# EAGLE design Minimum System ATMega 8 (EAGLE 9.6.2)
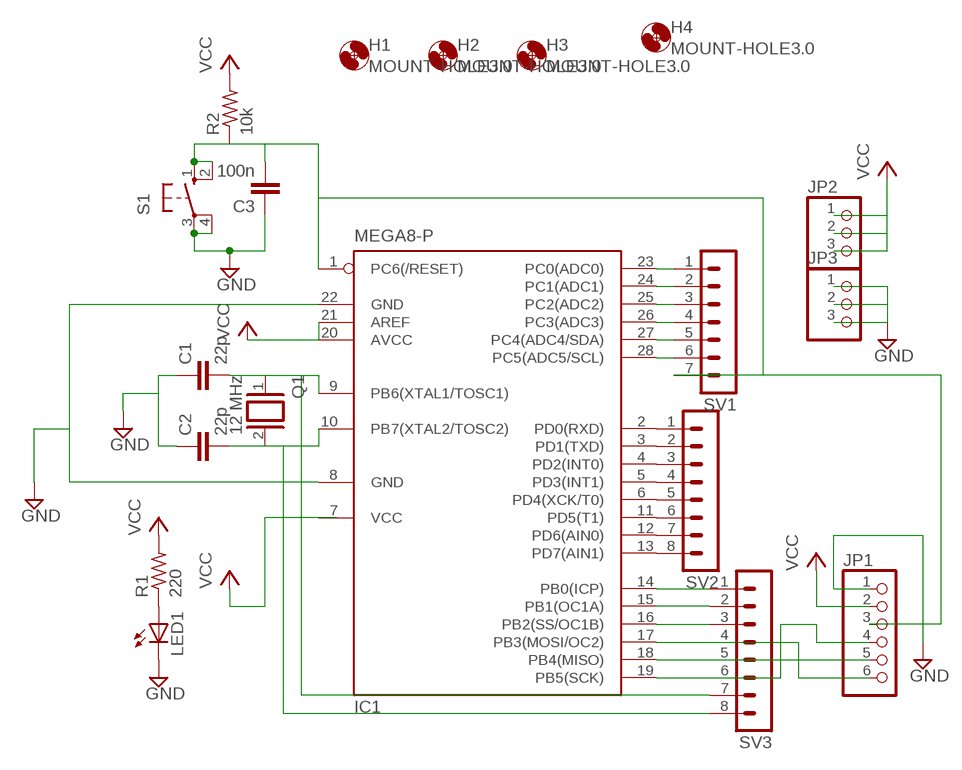
[diagram p0: schematic, sheet 1]

## Parts
C1  22p  C-EU025-030X050  [C025-030X050]
C2  22p  C-EU025-030X050  [C025-030X050]
C3  100n  C-EU025-030X050  [C025-030X050]
H1  MOUNT-HOLE3.0  [3,0]
H2  MOUNT-HOLE3.0  [3,0]
H3  MOUNT-HOLE3.0  [3,0]
H4  MOUNT-HOLE3.0  [3,0]
IC1  MEGA8-P  [DIL28-3]
JP1  PINHD-1X6/90  [1X06/90]
JP2  PINHD-1X3  [1X03]
JP3  PINHD-1X3  [1X03]
LED1  LED3MM  [LED3MM]
Q1  12 MHz  XTAL/S  [QS]
R1  220  R-US_0204/7  [0204/7]
R2  10k  R-US_0204/7  [0204/7]
S1  10-XX  [B3F-10XX]
SV1  MA07-1  [MA07-1]
SV2  MA08-1  [MA08-1]
SV3  MA08-1  [MA08-1]

## Nets
GND: C1.1 C2.1 C3.1 IC1.8(GND) IC1.22(GND) JP1.1 JP3.1 JP3.2 JP3.3 LED1.K(C) S1.3(P) S1.4(P1)
MISO: IC1.18(PB4(MISO)) JP1.5 SV3.5
MOSI: IC1.17(PB3(MOSI/OC2)) JP1.6 SV3.4
N$1: IC1.23(PC0(ADC0)) SV1.1
N$2: IC1.24(PC1(ADC1)) SV1.2
N$3: IC1.25(PC2(ADC2)) SV1.3
N$4: IC1.26(PC3(ADC3)) SV1.4
N$5: IC1.27(PC4(ADC4/SDA)) SV1.5
N$6: IC1.28(PC5(ADC5/SCL)) SV1.6
N$7: IC1.2(PD0(RXD)) SV2.1
N$8: IC1.3(PD1(TXD)) SV2.2
N$9: IC1.4(PD2(INT0)) SV2.3
N$10: IC1.5(PD3(INT1)) SV2.4
N$11: IC1.6(PD4(XCK/T0)) SV2.5
N$12: IC1.11(PD5(T1)) SV2.6
N$13: IC1.12(PD6(AIN0)) SV2.7
N$14: IC1.13(PD7(AIN1)) SV2.8
N$15: IC1.14(PB0(ICP)) SV3.1
N$16: IC1.15(PB1(OC1A)) SV3.2
N$17: IC1.16(PB2(SS/OC1B)) SV3.3
N$18: C1.2 IC1.9(PB6(XTAL1/TOSC1)) Q1.1 SV3.7
N$19: C3.2 IC1.1(PC6(/RESET)) JP1.3 R2.1 S1.1(S) S1.2(S1) SV1.7
N$20: IC1.19(PB5(SCK)) JP1.4 SV3.6
N$22: C2.2 IC1.10(PB7(XTAL2/TOSC2)) Q1.2 SV3.8
N$25: LED1.A R1.1
VCC: IC1.20(AVCC) IC1.21(AREF) JP1.2 JP2.1 JP2.2 JP2.3 R1.2 R2.2

## Power pins joined to a net without a drawn wire
VCC: IC1.7(VCC)

## Library data of the parts
C1-C3 = rcl:C-EU: CAPACITOR, European symbol
H1-H4 = holes:MOUNT-HOLE: MOUNTING HOLE with drill center marker
IC1 = atmel:MEGA8-P: MICROCONTROLLER 8 Kbytes FLASH, 1 kbytes SRAM, 512 bytes EEPROM, USART, 4-channel 10 bit ADC, 2-channel 8 bit ADC Pin compatible with Atmega48, ATMega88, ATMega168 Source: avr.lbr; OC_FARNELL: unknown; OC_NEWARK: unknown
JP1 = pinhead:PINHD-1X6: PIN HEADER
JP2 JP3 = pinhead:PINHD-1X3: PIN HEADER
LED1 = led:LED: LED OSRAM: - CHIPLED LG R971, LG N971, LY N971, LG Q971, LY Q971, LO R971, LY R971 LH N974, LH R974 LS Q976, LO Q976, LY Q976 LO Q996 - Hyper CHIPLED LW Q18S LB Q993, LB Q99A, LB R99A - SideLED LS A670, LO A670, LY A670, LG A670, LP A670 LB A673, LV A673, LT A673, LW A673 LH A674 LY A675 LS A676, LA A676, LO A676, LY A676, LW A676 LS A679, LY A679, LG A679 - Hyper Micro SIDELED® LS Y876, LA Y876, LO Y876, LY Y876 LT Y87S - SmartLED LW L88C, LW L88S LB L89C, LB L89S, LG L890 LS L89K, LO L89K, LY L89K LS L896, LA L896, LO L896, LY L896 - TOPLED LS T670, LO T670, LY T670, LG T670, LP T670 LSG T670, LSP T670, LSY T670, LOP T670, LYG T670 LG T671, LOG T671, LSG T671 LB T673, LV T673, LT T673, LW T673 LH T674 LS T676, LA T676, LO T676, LY T676, LB T676, LH T676, LSB T676, LW T676 LB T67C, LV T67C, LT T67C, LS T67K, LO T67K, LY T67K, LW E67C LS E67B, LA E67B, LO E67B, LY E67B, LB E67C, LV E67C, LT E67C LW T67C LS T679, LY T679, LG T679 LS T770, LO T770, LY T770, LG T770, LP T770 LB T773, LV T773, LT T773, LW T773 LH T774 LS E675, LA E675, LY E675, LS T675 LS T776, LA T776, LO T776, LY T776, LB T776 LHGB T686 LT T68C, LB T68C - Hyper Mini TOPLED® LB M676 - Mini TOPLED Santana® LG M470 LS M47K, LO M47K, LY M47K Source: http://www.osram.convergy.de LUXEON: - LUMILED® LXK2-PW12-R00, LXK2-PW12-S00, LXK2-PW14-U00, LXK2-PW14-V00 LXK2-PM12-R00, LXK2-PM12-S00, LXK2-PM14-U00 LXK2-PE12-Q00, LXK2-PE12-R00, LXK2-PE12-S00, LXK2-PE14-T00, LXK2-PE14-U00 LXK2-PB12-K00, LXK2-PB12-L00, LXK2-PB12-M00, LXK2-PB14-N00, LXK2-PB14-P00, LXK2-PB14-Q00 LXK2-PR12-L00, LXK2-PR12-M00, LXK2-PR14-Q00, LXK2-PR14-R00 LXK2-PD12-Q00, LXK2-PD12-R00, LXK2-PD12-S00 LXK2-PH12-R00, LXK2-PH12-S00 LXK2-PL12-P00, LXK2-PL12-Q00, LXK2-PL12-R00 Source: www.luxeon.com KINGBRIGHT: KA-3528ASYC Source: www.kingbright.com
Q1 = special:XTAL/S: CRYSTAL
R1 R2 = rcl:R-US_: RESISTOR, American symbol
S1 = switch-omron:10-XX: OMRON SWITCH; MPN: B3F-1000; OC_FARNELL: 176432; OC_NEWARK: 36M3542
SV1 = con-lstb:MA07-1: PIN HEADER; OC_FARNELL: unknown; OC_NEWARK: unknown
SV2 SV3 = con-lstb:MA08-1: PIN HEADER; OC_FARNELL: unknown; OC_NEWARK: unknown

## Board
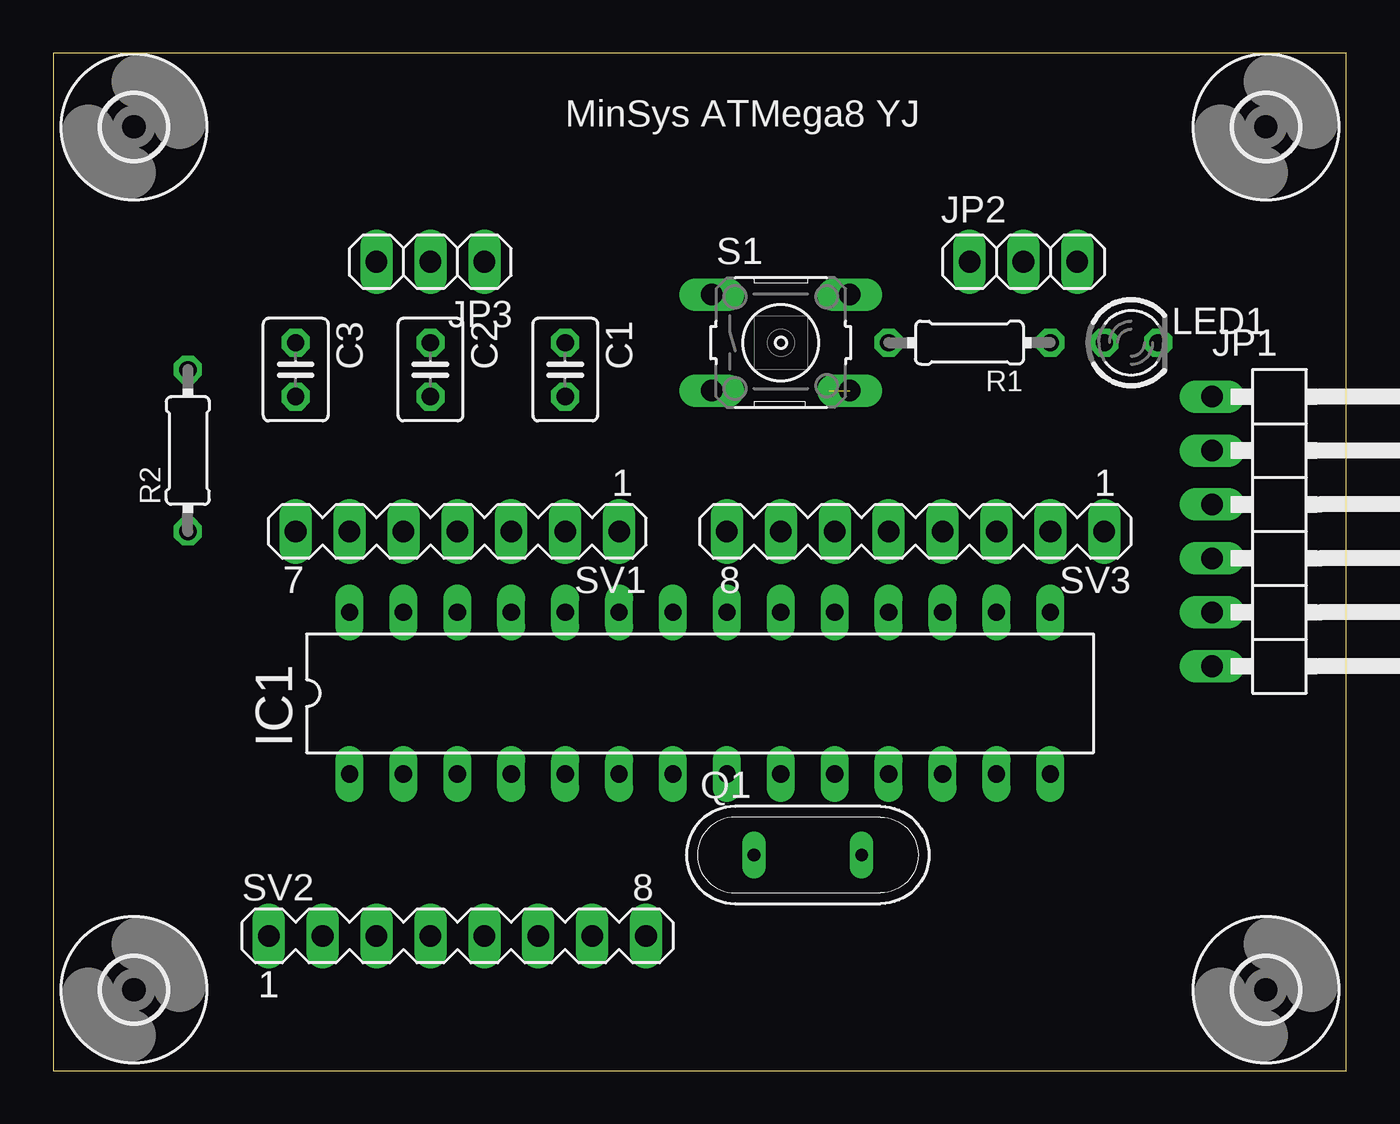
[diagram p1: board, top side]
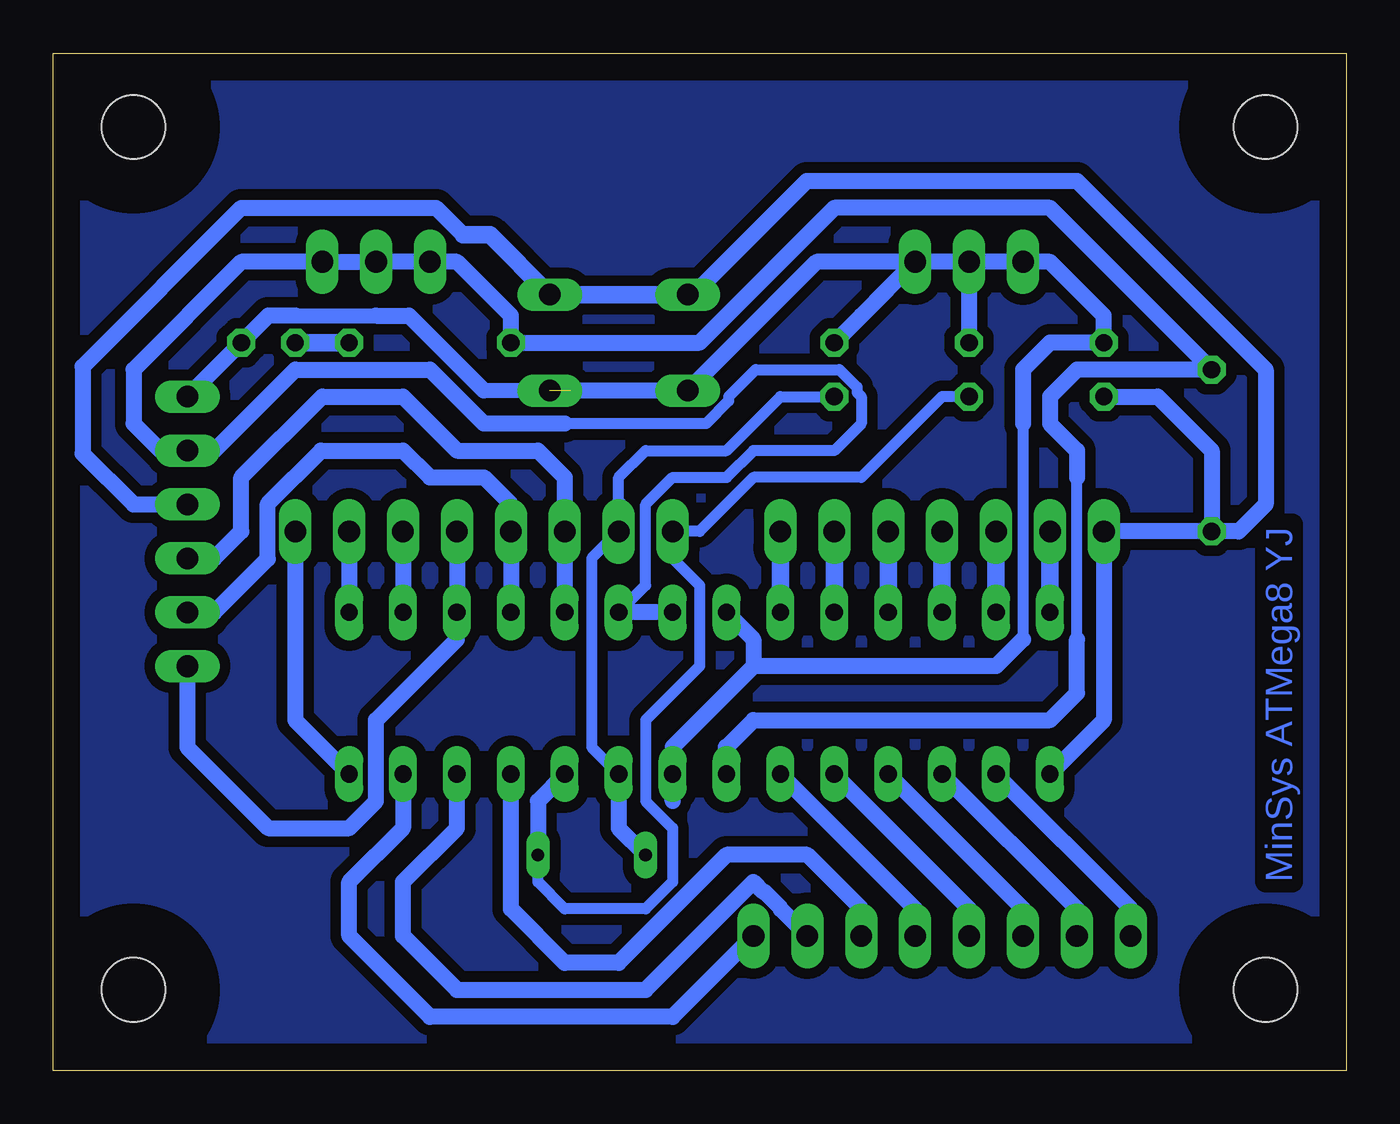
[diagram p2: board, bottom side, seen from below]

Size 60.94 x 47.93 mm. Coordinates in mm from the lower left corner, seen from the top.
Outline: 0,0 60.94,0 60.94,47.93 0,47.93 0,0
Copper layers (1*16): Top 0.035mm / dielectric 1.5mm / Bottom 0.035mm
Design rules "default *": minimum track width 6mil, minimum drill 0.35mm, track to track 20mil, track to pad 20mil, pad to pad 20mil, via to via 20mil, smd to smd 20mil, copper to edge 50mil, drill to drill 6mil, minimum pad ring 10mil, minimum via ring 8mil, stop-mask expansion 4mil, vias tented up to drill 0mil, thermal gap 10mil

### Footprints (pad centres in the part's own frame; a part is rotated, then mirrored left to right if it is on the bottom)
C025-030X050 = drill 0.813 octagon: 1 -1.27,0; 2 1.27,0
3,0 = hole 3: 0,0
DIL28-3 = drill 0.813 long: 1 -16.51,-3.81; 2 -13.97,-3.81; 3 -11.43,-3.81; 4 -8.89,-3.81; 5 -6.35,-3.81; 6 -3.81,-3.81; 7 -1.27,-3.81; 8 1.27,-3.81; 9 3.81,-3.81; 10 6.35,-3.81; 11 8.89,-3.81; 12 11.43,-3.81; 13 13.97,-3.81; 14 16.51,-3.81; 15 16.51,3.81; 16 13.97,3.81; 17 11.43,3.81; 18 8.89,3.81; 19 6.35,3.81; 20 3.81,3.81; 21 1.27,3.81; 22 -1.27,3.81; 23 -3.81,3.81; 24 -6.35,3.81; 25 -8.89,3.81; 26 -11.43,3.81; 27 -13.97,3.81; 28 -16.51,3.81
1X06/90 = drill 1.016 long: 1 -6.35,-3.81; 2 -3.81,-3.81; 3 -1.27,-3.81; 4 1.27,-3.81; 5 3.81,-3.81; 6 6.35,-3.81
1X03 = drill 1.016 long: 1 -2.54,0; 2 0,0; 3 2.54,0
LED3MM = drill 0.813 octagon: A -1.27,0; K 1.27,0
QS = drill 0.61 long: 1 -2.54,0; 2 2.54,0
0204/7 = drill 0.813 octagon: 1 -3.81,0; 2 3.81,0
B3F-10XX = drill 1.016 long: 1 -3.251,2.261; 2 3.251,2.261; 3 -3.251,-2.261; 4 3.251,-2.261
MA07-1 = drill 1.016 long: 1 -7.62,0; 2 -5.08,0; 3 -2.54,0; 4 0,0; 5 2.54,0; 6 5.08,0; 7 7.62,0
MA08-1 = drill 1.016 long: 1 -8.89,0; 2 -6.35,0; 3 -3.81,0; 4 -1.27,0; 5 1.27,0; 6 3.81,0; 7 6.35,0; 8 8.89,0

### Placement (x,y rotation side)
C1  24.13,33.02 270 top
C2  17.78,33.02 270 top
C3  11.43,33.02 270 top
H1  57.15,44.45 0 top
H2  3.81,3.81 0 top
H3  57.15,3.81 0 top
H4  3.81,44.45 0 top
IC1  30.48,17.78 0 top
JP1  58.42,25.4 270 top
JP2  45.72,38.1 0 top
JP3  17.78,38.1 180 top
LED1  50.8,34.29 0 top
Q1  35.56,10.16 0 top
R1  43.18,34.29 180 top
R2  6.35,29.21 90 top
S1  34.29,34.29 0 top
SV1  19.05,25.4 180 top
SV2  19.05,6.35 0 top
SV3  40.64,25.4 180 top

### Tracks (layer width: path | path; a pad name or v marks a point on that pad's centre or on a via)
AGND
  pour Bottom: 0,48.26 60.96,48.26 60.96,0 0,0
GND  (1 unrouted)
  Bottom 0.508: 15.24,30.48 15.24,20.32
  Bottom 0.711: S1.4 40.64,32.03 | 49.53,35.56 45.72,35.56
  Bottom 0.762: 49.53,35.56 50.8,35.56 LED1.K JP1.1 | 36.55,32.03 S1.3 24.97,38.1 JP3.1 | JP3.2 JP3.3 13.97,38.1 11.43,35.56 C3.1 13.97,34.29 15.24,33.02 15.24,30.48 | JP3.2 JP3.1 | JP3.1 22.86,35.56 | 31.75,12.7 IC1.8 31.75,15.24 27.94,19.05 | 40.64,32.03 44.17,35.56 45.72,35.56 | JP3.2 C2.1 | C1.1 JP3.1 | 15.24,20.32 16.51,19.05 27.94,19.05 | IC1.22 27.94,20.32 27.94,19.05
MISO
  Bottom 0.762: IC1.18 SV3.5 39.37,26.67 40.64,27.94 43.18,27.94 44.45,29.21 48.31,29.21 50.82,26.7 50.82,24.11 53.34,21.59 JP1.5
MOSI
  Bottom 0.762: JP1.6 54.61,15.24 50.8,11.43 46.99,11.43 45.72,12.7 45.72,16.51 41.91,20.32 IC1.17 SV3.4
N$1
  Bottom 0.813: SV1.1 IC1.23
N$2
  Bottom 0.813: SV1.2 IC1.24
N$3
  Bottom 0.813: SV1.3 IC1.25
N$4
  Bottom 0.813: SV1.4 IC1.26
N$5
  Bottom 0.813: SV1.5 IC1.27
N$6
  Bottom 0.813: SV1.6 IC1.28
N$7
  Bottom 0.762: IC1.2 10.16,7.62 SV2.1
N$8
  Bottom 0.762: IC1.3 12.7,7.62 SV2.2
N$9
  Bottom 0.762: IC1.4 15.24,7.62 SV2.3
N$10
  Bottom 0.762: IC1.5 17.78,7.62 SV2.4
N$11
  Bottom 0.762: IC1.6 20.32,7.62 SV2.5
N$12
  Bottom 0.762: IC1.11 39.37,7.62 36.83,5.08 34.29,5.08 29.21,10.16 25.4,10.16 22.86,7.62 SV2.6
N$13
  Bottom 0.762: 41.91,12.7 IC1.12 41.91,11.43 44.45,8.89 44.45,6.35 41.91,3.81 33.02,3.81 27.94,8.89 27.46,8.41 27.4,8.41 26.64,7.65 26.64,7.6 SV2.7
N$14
  Bottom 0.762: IC1.13 44.45,11.43 46.99,8.89 46.99,6.35 43.18,2.54 31.75,2.54 SV2.8
N$15
  Bottom 0.762: SV3.1 49.53,16.51 IC1.14
N$16
  Bottom 0.762: SV3.2 IC1.15
N$17
  Bottom 0.762: SV3.3 IC1.16
N$18
  Bottom 0.508: SV3.7 34.8,25.4 | SV3.7 34.29,27.94 33.02,29.21 29.21,29.21 26.67,31.75 C1.2 | SV3.7 35.56,24.13 35.56,15.24 IC1.9
  Bottom 0.762: 34.29,26.67 SV3.7 | IC1.9 34.29,11.43 Q1.1
N$19
  Bottom 0.762: S1.1 30.78,36.55 25.42,41.91 12.7,41.91 3.81,33.02 3.81,26.67 5.08,25.4 R2.1 | R2.1 SV1.7 11.43,16.51 IC1.1 | 41.63,39.37 42.9,40.64 52.07,40.64 59.54,33.17 59.54,29.06 57.15,26.67 JP1.3 | C3.2 8.89,31.75 6.35,29.21 R2.1
  Bottom 0.813: 41.63,39.37 40.36,39.37 S1.2 S1.1 30.93,36.45
N$20
  Bottom 0.762: JP1.4 53.34,24.13 52.07,25.4 52.07,27.94 48.26,31.75 44.45,31.75 41.91,29.21 38.1,29.21 36.83,27.94 SV3.6 IC1.19
N$22
  Bottom 0.508: Q1.2 38.1,8.89 36.83,7.62 33.02,7.62 31.75,8.89 31.75,11.43 33.02,12.7 33.02,16.51 30.48,19.05 30.48,22.86 31.75,24.13 SV3.8 30.48,25.4 27.94,27.94 22.86,27.94 19.05,31.75 C2.2
  Bottom 0.762: IC1.10 38.1,12.7 Q1.2
N$25
  Bottom 0.813: LED1.A R1.1
VCC
  Bottom 0.508: 12.7,20.32 12.7,27.94 | IC1.20 33.02,22.86 33.02,26.67 31.75,27.94 29.21,27.94 27.94,29.21 24.13,29.21 22.86,30.48 22.86,31.75 23.06,31.95 23.06,32.19 23.89,33.02 27.84,33.02 29.11,31.75 29.11,31.54 30.17,30.48 36.83,30.48
  Bottom 0.762: 36.83,30.48 40.64,30.48 43.18,33.02 49.53,33.02 53.34,29.21 JP1.2 55.88,29.21 57.15,30.48 57.15,33.02 52.07,38.1 JP2.3 JP2.2 JP2.1 41.91,38.1 39.37,35.56 R1.2 30.48,34.29 24.13,40.64 13.97,40.64 R2.2 12.7,33.02 13.97,31.75 13.97,30.48 12.7,29.21 12.7,27.94 | 29.21,15.24 27.94,16.51 13.97,16.51 12.7,17.78 12.7,20.32 | IC1.21 IC1.20
  Bottom 0.813: 29.21,15.24 IC1.7

### Text on the board
Bottom: MinSys ATMega8 YJ
tPlace: MinSys ATMega8 YJ